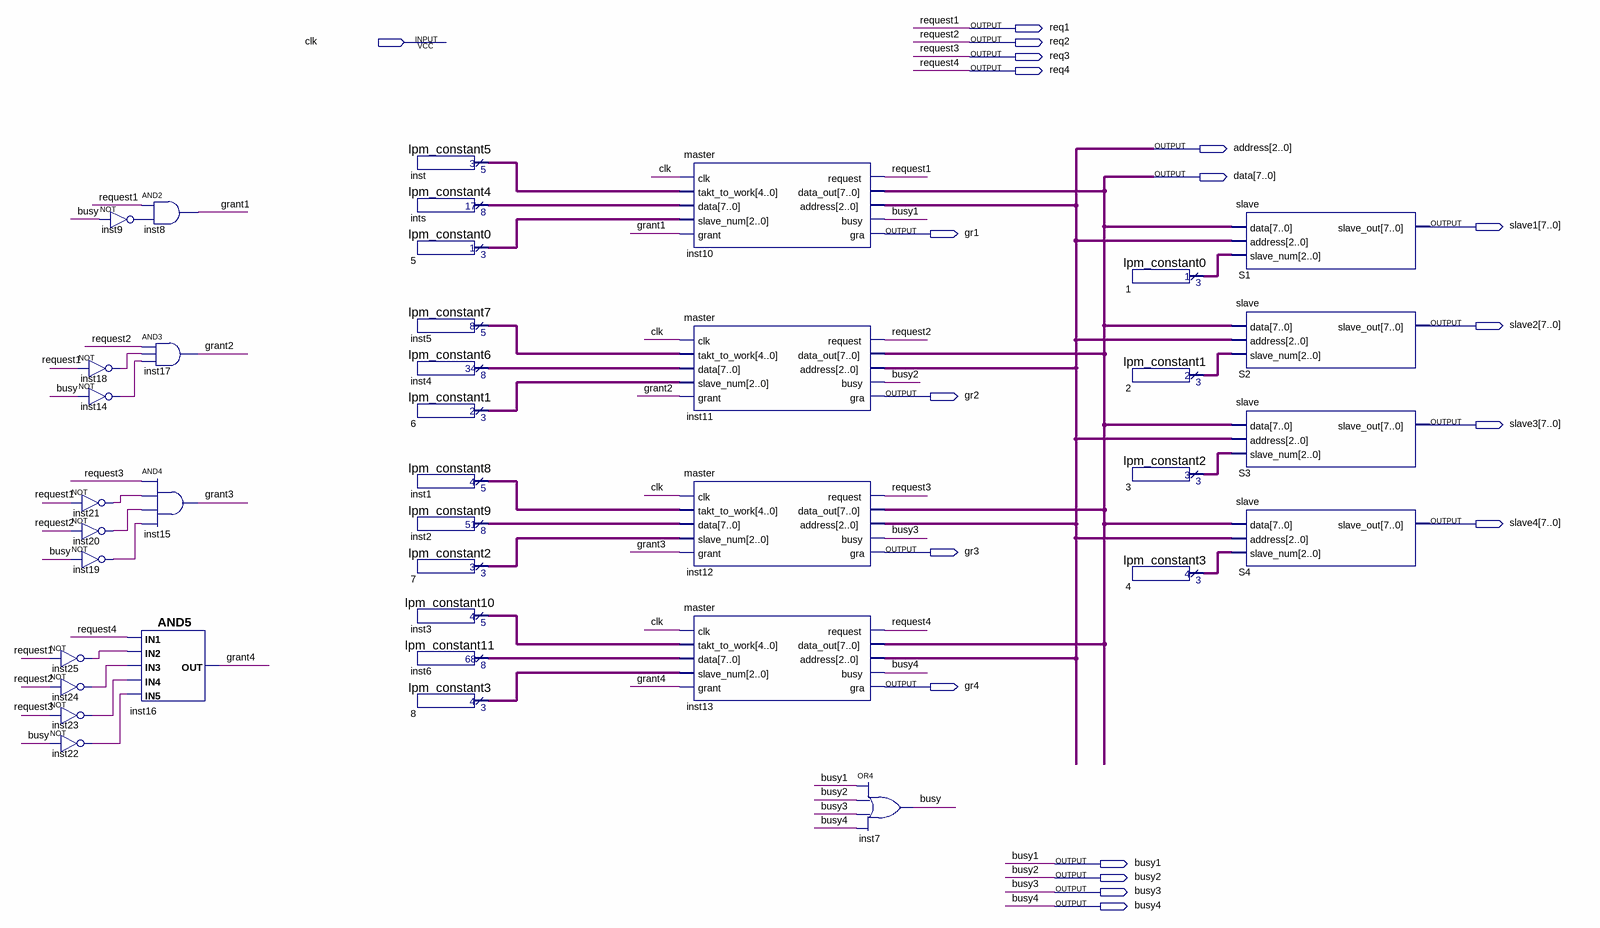
[diagram p0: schematic sheet]
// Quartus schematic lab5.bdf as structural Verilog: 39 symbols, 19 pins
module lab5 (
  input  clk,
  output req1,
  output req2,
  output req3,
  output req4,
  output [2:0] address,
  output [7:0] data,
  output [7:0] slave1,
  output gr1,
  output [7:0] slave2,
  output gr2,
  output [7:0] slave3,
  output [7:0] slave4,
  output gr3,
  output gr4,
  output busy1,
  output busy2,
  output busy3,
  output busy4
);

  wire busy, grant1, grant2, grant3, grant4, inst9_out, inst14_out, inst18_out, inst19_out, inst20_out,
       inst21_out, inst22_out, inst23_out, inst24_out, inst25_out;
  wire [2:0] n1_result, n2_result, n3_result, n4_result, n5_result, n6_result, n7_result, n8_result;
  wire [4:0] inst1_result, inst3_result, inst5_result, inst_result;
  wire [7:0] inst2_result, inst4_result, inst6_result, ints_result;

  not inst18 (inst18_out, req1);
  not inst14 (inst14_out, busy);
  not inst21 (inst21_out, req1);
  not inst20 (inst20_out, req2);
  not inst19 (inst19_out, busy);
  not inst25 (inst25_out, req1);
  not inst24 (inst24_out, req2);
  not inst23 (inst23_out, req3);
  not inst22 (inst22_out, busy);
  and inst8 (grant1, req1, inst9_out);
  not inst9 (inst9_out, busy);
  and inst17 (grant2, req2, inst18_out, inst14_out);
  and inst15 (grant3, req3, inst21_out, inst20_out, inst19_out);
  and inst16 (grant4, req4, inst25_out, inst24_out, inst23_out, inst22_out);
  lpm_constant5 inst (.result(inst_result));
  lpm_constant4 ints (.result(ints_result));
  lpm_constant0 u_5 (.result(n5_result));
  lpm_constant7 inst5 (.result(inst5_result));
  lpm_constant6 inst4 (.result(inst4_result));
  lpm_constant1 u_6 (.result(n6_result));
  lpm_constant8 inst1 (.result(inst1_result));
  lpm_constant9 inst2 (.result(inst2_result));
  lpm_constant2 u_7 (.result(n7_result));
  lpm_constant10 inst3 (.result(inst3_result));
  lpm_constant11 inst6 (.result(inst6_result));
  lpm_constant3 u_8 (.result(n8_result));
  master inst10 (
    .clk(clk), .takt_to_work(inst_result), .data(ints_result), .slave_num(n5_result), .grant(grant1),
    .request(req1), .data_out(data), .address(address), .busy(busy1), .gra(gr1));
  master inst11 (
    .clk(clk), .takt_to_work(inst5_result), .data(inst4_result), .slave_num(n6_result), .grant(grant2),
    .request(req2), .data_out(data), .address(address), .busy(busy2), .gra(gr2));
  master inst12 (
    .clk(clk), .takt_to_work(inst1_result), .data(inst2_result), .slave_num(n7_result), .grant(grant3),
    .request(req3), .data_out(data), .address(address), .busy(busy3), .gra(gr3));
  master inst13 (
    .clk(clk), .takt_to_work(inst3_result), .data(inst6_result), .slave_num(n8_result), .grant(grant4),
    .request(req4), .data_out(data), .address(address), .busy(busy4), .gra(gr4));
  or inst7 (busy, busy1, busy2, busy3, busy4);
  lpm_constant0 u_1 (.result(n1_result));
  lpm_constant1 u_2 (.result(n2_result));
  lpm_constant2 u_3 (.result(n3_result));
  lpm_constant3 u_4 (.result(n4_result));
  slave S1 (.data(data), .address(address), .slave_num(n1_result), .slave_out(slave1));
  slave S2 (.data(data), .address(address), .slave_num(n2_result), .slave_out(slave2));
  slave S3 (.data(data), .address(address), .slave_num(n3_result), .slave_out(slave3));
  slave S4 (.data(data), .address(address), .slave_num(n4_result), .slave_out(slave4));

  // Other names for the same wires on the sheet: request1 = req1; request2 = req2; request3 = req3; request4 = req4
endmodule
